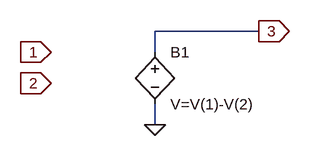
[diagram p0: schematic subtractor.asc]
subtractor.asc, the LTspice schematic file:
Version 4
SHEET 1 880 680
WIRE 384 128 224 128
WIRE 224 160 224 128
WIRE 224 272 224 240
FLAG 64 160 1
IOPIN 64 160 In
FLAG 64 208 2
IOPIN 64 208 In
FLAG 224 272 0
FLAG 384 128 3
IOPIN 384 128 Out
SYMBOL bv 224 144 R0
SYMATTR InstName B1
SYMATTR Value V=V(1)-V(2)

The netlist it stands for:
* subtractor.asc
B1 3 0 V=V(1)-V(2)
.backanno
.end